# EAGLE design Barometer 022 (EAGLE 9.6.2)

## Sheet 1 of 4
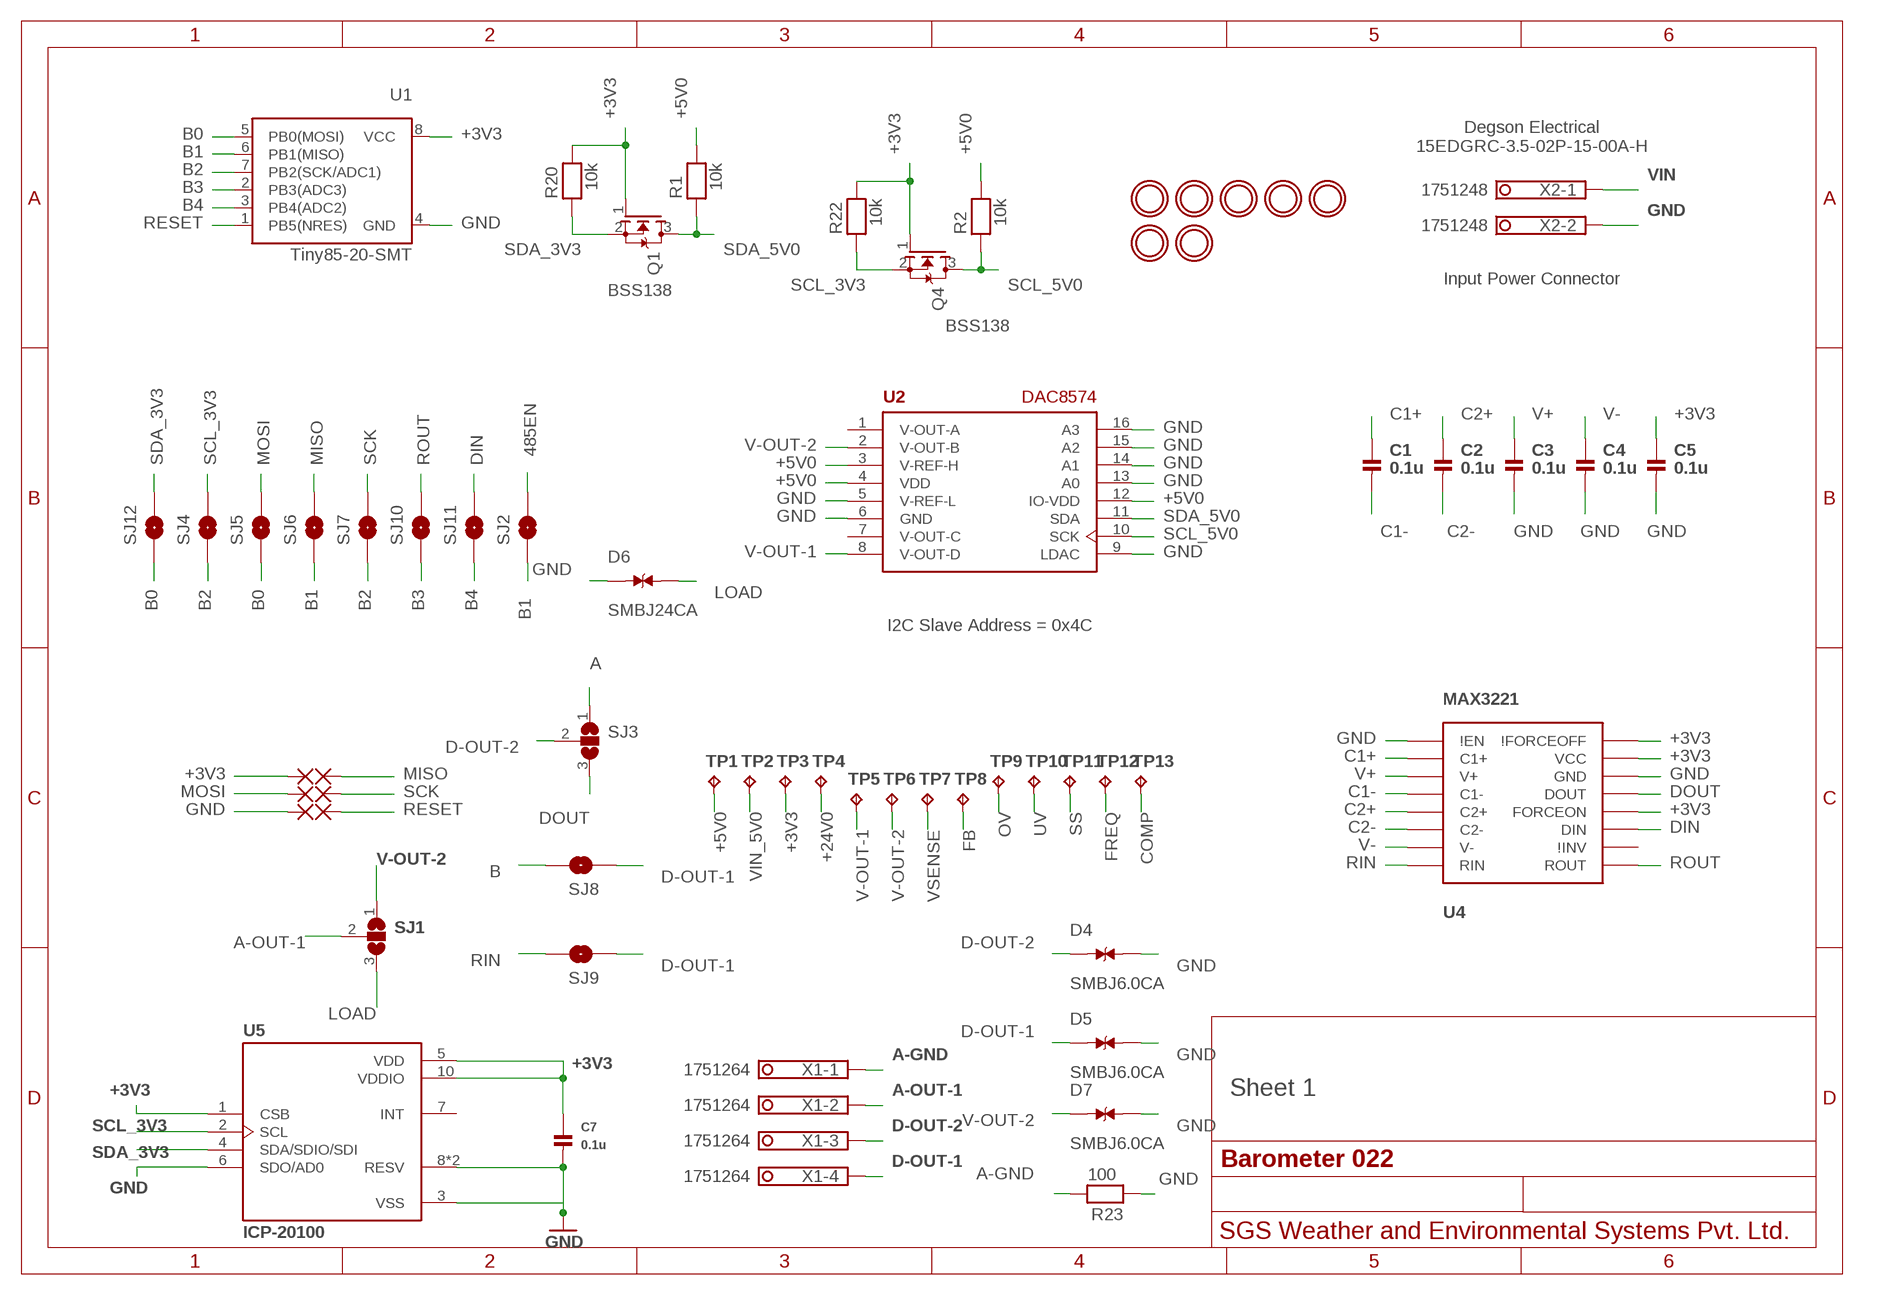
[diagram p0: schematic, sheet 1]

### Parts
C1  0.1u  CAP_CERAMIC0603  [0603@1]
C2  0.1u  CAP_CERAMIC0603  [0603@1]
C3  0.1u  CAP_CERAMIC0603  [0603@1]
C4  0.1u  CAP_CERAMIC0603  [0603@1]
C5  0.1u  CAP_CERAMIC0603  [0603@1]
C7  0.1u  CAP_CERAMIC0603  [0603@1]
D4  SMBJ6.0CA  [DIOM4336X265N]
D5  SMBJ6.0CA  [DIOM4336X265N]
D6  SMBJ24CA  [DIOM4336X265N]
D7  SMBJ6.0CA  [DIOM4336X265N]
PAD1  SMD2  [SMD1,27-2,54]
PAD2  SMD2  [SMD1,27-2,54]
PAD3  SMD2  [SMD1,27-2,54]
PAD4  SMD2  [SMD1,27-2,54]
PAD5  SMD2  [SMD1,27-2,54]
PAD6  SMD2  [SMD1,27-2,54]
Q1  MOSFET-NWIDE  [SOT23-WIDE]
Q4  MOSFET-NWIDE  [SOT23-WIDE]
R1  10k  RESISTOR0603  [0603]
R2  10k  RESISTOR0603  [0603]
R20  10k  RESISTOR0603  [0603]
R22  10k  RESISTOR0603  [0603]
R23  100  RESISTOR0603  [0603]
SJ1  SJ2WW  [SJ_2W]
SJ2  SOLDERJUMPERTRACE  [SJ_2S-TRACE]
SJ3  SJ2W  [SJ_2]
SJ4  SOLDERJUMPERTRACE  [SJ_2S-TRACE]
SJ5  SOLDERJUMPERTRACE  [SJ_2S-TRACE]
SJ6  SOLDERJUMPERTRACE  [SJ_2S-TRACE]
SJ7  SOLDERJUMPERTRACE  [SJ_2S-TRACE]
SJ8  SOLDERJUMPERTRACE  [SJ_2S-TRACE]
SJ9  SOLDERJUMPERTRACE  [SJ_2S-TRACE]
SJ10  SOLDERJUMPERTRACE  [SJ_2S-TRACE]
SJ11  SOLDERJUMPERTRACE  [SJ_2S-TRACE]
SJ12  SOLDERJUMPERNO  [SJ_2S-NO]
TP1  TPB1,27  [B1,27]
TP2  TPB1,27  [B1,27]
TP3  TPB1,27  [B1,27]
TP4  TPB1,27  [B1,27]
TP5  TPB1,27  [B1,27]
TP6  TPB1,27  [B1,27]
TP7  TPB1,27  [B1,27]
TP8  TPB1,27  [B1,27]
TP9  TPB1,27  [B1,27]
TP10  TPB1,27  [B1,27]
TP11  TPB1,27  [B1,27]
TP12  TPB1,27  [B1,27]
TP13  TPB1,27  [B1,27]
U1  Tiny85-20-SMT  ATTINY45TINY85-20-SMT  [SO08-EIAJ_MCU]
U2  DAC8574  [TSSOP16]
U4  MAX3221  MAX3221-TSSOP16  [TSSOP16]
U5  ICP-20100  [PQFN50P200X200X85-10N]
U$1  MOUNTINGHOLE3.0THIN  [MOUNTINGHOLE_3.0_PLATEDTHIN]
U$2  MOUNTINGHOLE3.0THIN  [MOUNTINGHOLE_3.0_PLATEDTHIN]
U$3  MOUNTINGHOLE3.0THIN  [MOUNTINGHOLE_3.0_PLATEDTHIN]
U$4  MOUNTINGHOLE3.0THIN  [MOUNTINGHOLE_3.0_PLATEDTHIN]
U$5  MOUNTINGHOLE3.0THIN  [MOUNTINGHOLE_3.0_PLATEDTHIN]
U$6  MOUNTINGHOLE3.0THIN  [MOUNTINGHOLE_3.0_PLATEDTHIN]
U$7  MOUNTINGHOLE3.0THIN  [MOUNTINGHOLE_3.0_PLATEDTHIN]
X1  1751264  [1751264]
X2  1751248  [1751248]

### Nets
485EN: SJ2.2 ; also sheet 3
+3V3: C5.1 C7.1 PAD1.1(P) Q1.1(G) Q4.1(G) R20.2 R22.2 TP3.TP U1.8(VCC) U4.12(FORCEON) U4.15(VCC) U4.16(\!FORCEOFF) U5.1(CSB) U5.5(VDD) U5.10(VDDIO) ; also sheet 2,3
+5V0: R1.2 R2.2 TP1.TP U2.3(V-REF-H) U2.4(VDD) U2.12(IO-VDD) ; also sheet 2
+24V0: TP4.TP ; also sheet 2,3
A: SJ3.1 ; also sheet 3
A-GND: R23.2 X1.1
A-OUT-1: SJ1.2 X1.2
B: SJ8.2 ; also sheet 3
B0: SJ5.1 SJ12.1 U1.5(PB0(MOSI))
B1: SJ2.1 SJ6.1 U1.6(PB1(MISO))
B2: SJ4.1 SJ7.1 U1.7(PB2(SCK/ADC1))
B3: SJ10.1 U1.2(PB3(ADC3))
B4: SJ11.1 U1.3(PB4(ADC2))
C1+: C1.1 U4.2(C1+)
C1-: C1.2 U4.4(C1-)
C2+: C2.1 U4.5(C2+)
C2-: C2.2 U4.6(C2-)
COMP: TP13.TP ; also sheet 2
D-OUT-1: D5.1 SJ8.1 SJ9.1 X1.4
D-OUT-2: D4.1 SJ3.2 X1.3
DIN: SJ11.2 U4.11(DIN) ; also sheet 3
DOUT: SJ3.3 U4.13(DOUT)
FB: TP8.TP ; also sheet 2
FREQ: TP12.TP ; also sheet 2
GND: C3.2 C4.2 C5.2 C7.2 D4.2 D5.2 D6.1 D7.2 PAD5.1(P) R23.1 U1.4(GND) U2.5(V-REF-L) U2.6(GND) U2.9(LDAC) U2.13(A0) U2.14(A1) U2.15(A2) U2.16(A3) U4.1(\!EN) U4.14(GND) U5.3(VSS) U5.6(SDO/AD0) U5.8(RESV) U5.9(RESV) X2.2 ; also sheet 2,3
LOAD: D6.2 SJ1.3 ; also sheet 3
MISO: PAD2.1(P) SJ6.2
MOSI: PAD3.1(P) SJ5.2
OV: TP9.TP ; also sheet 2
RESET: PAD6.1(P) U1.1(PB5(NRES))
RIN: SJ9.2 U4.8(RIN)
ROUT: SJ10.2 U4.9(ROUT) ; also sheet 3
SCK: PAD4.1(P) SJ7.2
SCL_3V3: Q4.2(S) R22.1 SJ4.2 U5.2(SCL)
SCL_5V0: Q4.3(D) R2.1 U2.10(SCK)
SDA_3V3: Q1.2(S) R20.1 SJ12.2 U5.4(SDA/SDIO/SDI)
SDA_5V0: Q1.3(D) R1.1 U2.11(SDA)
SS: TP11.TP ; also sheet 2
UV: TP10.TP ; also sheet 2
V+: C3.1 U4.3(V+)
V-: C4.1 U4.7(V-)
V-OUT-1: TP5.TP U2.8(V-OUT-D) ; also sheet 3
V-OUT-2: D7.1 SJ1.1 TP6.TP U2.2(V-OUT-B)
VIN: X2.1 ; also sheet 2
VIN_5V0: TP2.TP ; also sheet 2
VSENSE: TP7.TP ; also sheet 2
Unconnected: U2.1(V-OUT-A) U2.7(V-OUT-C) U4.10(\!INV) U5.7(INT)

### Notes on the sheet
- Degson Electrical
  15EDGRC-3.5-02P-15-00A-H
- Input Power Connector
- BSS138
- BSS138
- I2C Slave Address = 0x4C
- Sheet 1

## Sheet 2 of 4
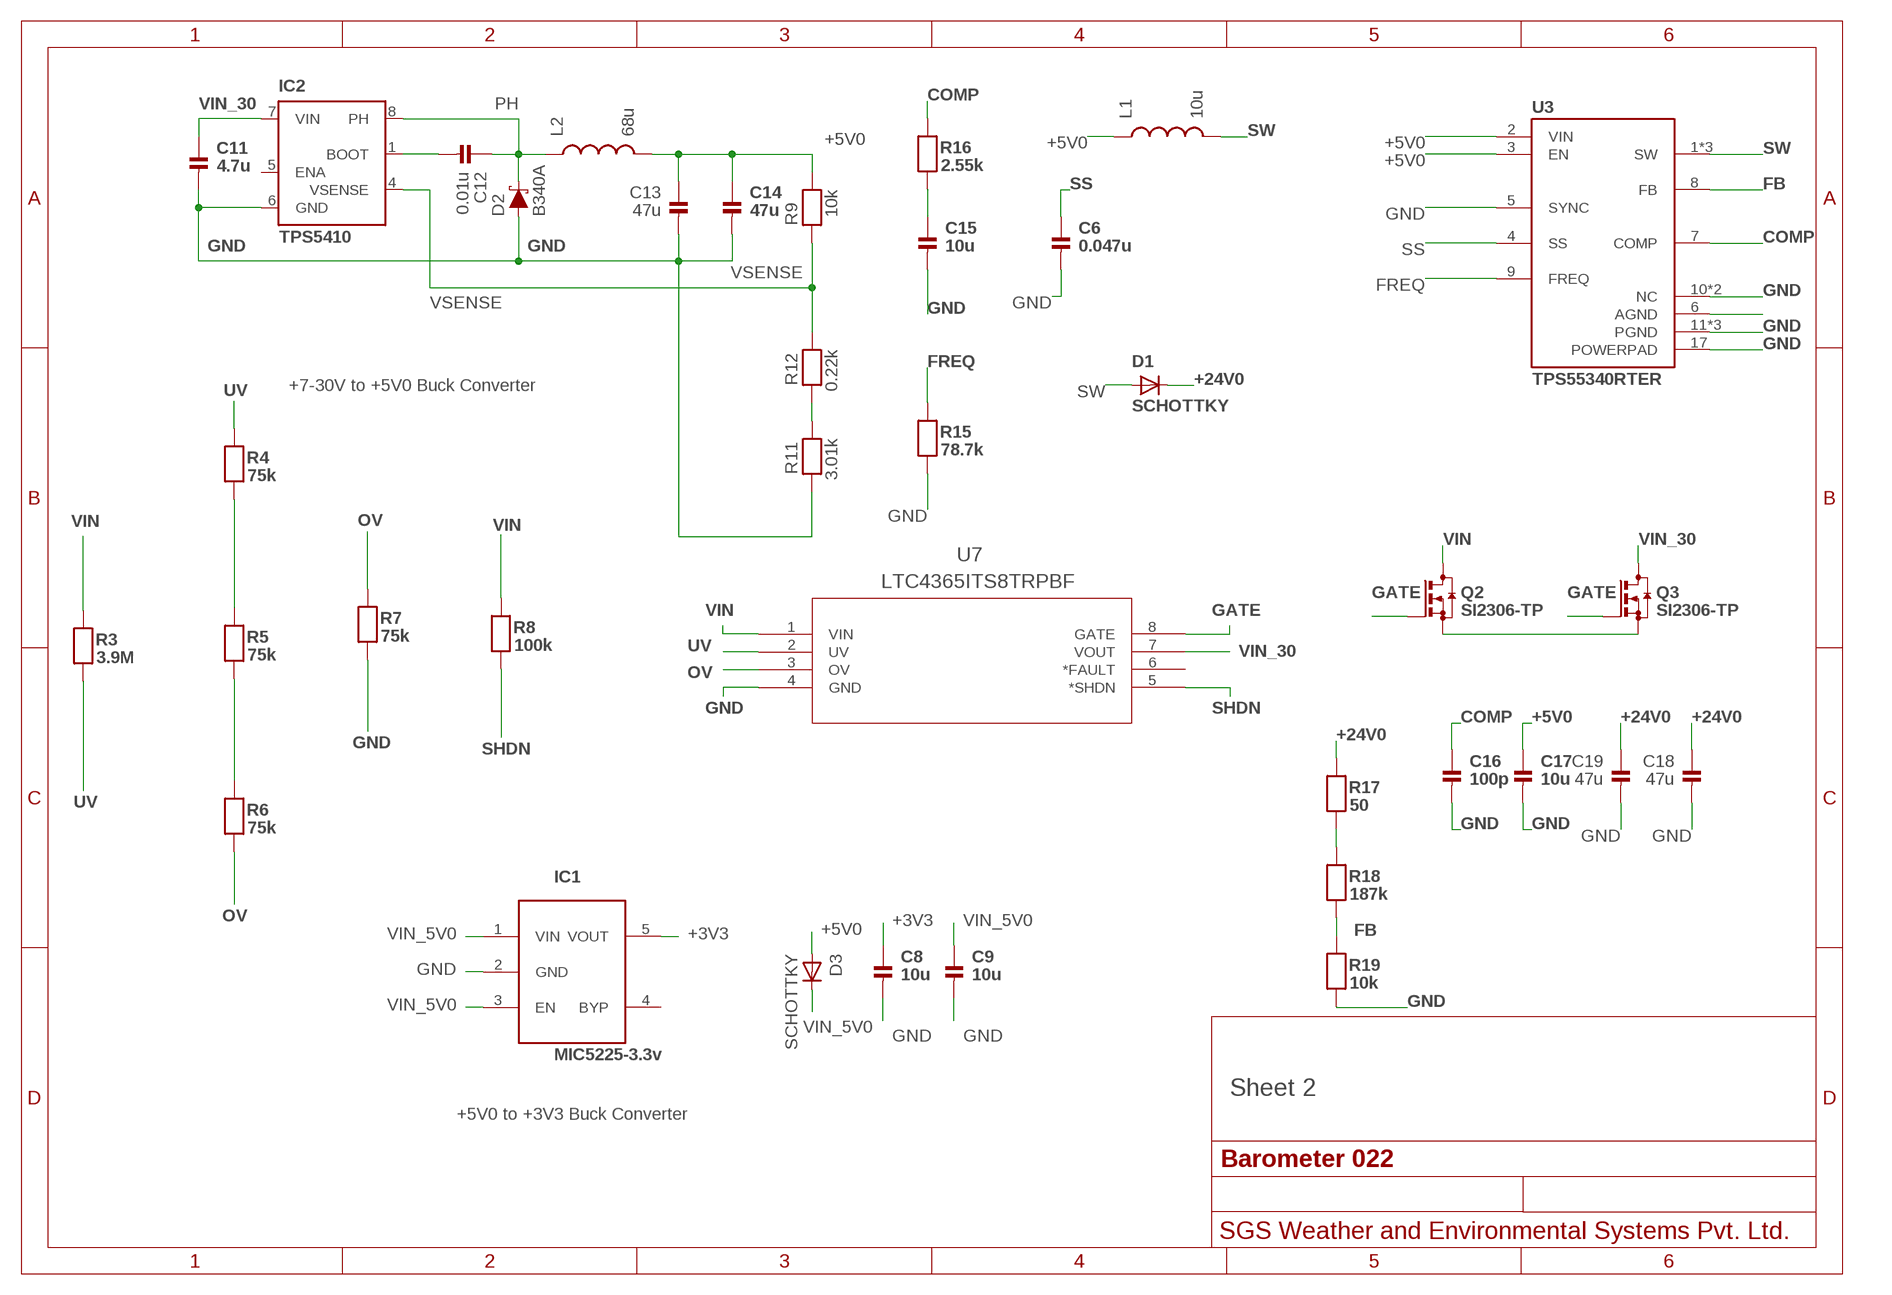
[diagram p1: schematic, sheet 2]

### Parts
C6  0.047u  CAP_CERAMIC0603  [0603@1]
C8  10u  CAP_CERAMIC0603  [0603@1]
C9  10u  CAP_CERAMIC0603  [0603@1]
C11  4.7u  CAP_CERAMIC0805  [0805@1]
C12  0.01u  CAP_CERAMIC0603  [0603@1]
C13  47u  CAP_CERAMIC1206  [1206@1]
C14  47u  CAP_CERAMIC1206  [1206@1]
C15  10u  CAP_CERAMIC0603  [0603@1]
C16  100p  CAP_CERAMIC0603  [0603@1]
C17  10u  CAP_CERAMIC0603  [0603@1]
C18  47u  CAP_CERAMIC1206  [1206@1]
C19  47u  CAP_CERAMIC1206  [1206@1]
D1  SCHOTTKY  DIODE_SOD-123FL  [SOD-123FL]
D2  B340A  DIODE-SCHOTTKY-B340A  [SMA-DIODE]
D3  SCHOTTKY  DIODE_SOD-123FL  [SOD-123FL]
IC1  MIC5225-3.3v  LP298XS  [SOT23-5L]
IC2  TPS5410  [D_R-PDSO-G08]
L1  10u  INDUCTOR-TDKVLS6045EX  [VLS6045EX]
L2  68u  INDUCTOR-TDKVLS6045EX  [VLS6045EX]
Q2  SI2306-TP  BSS123  [SOT23]
Q3  SI2306-TP  BSS123  [SOT23]
R3  3.9M  RESISTOR0603  [0603]
R4  75k  RESISTOR0603  [0603]
R5  75k  RESISTOR0603  [0603]
R6  75k  RESISTOR0603  [0603]
R7  75k  RESISTOR0603  [0603]
R8  100k  RESISTOR0603  [0603]
R9  10k  RESISTOR0603  [0603]
R11  3.01k  RESISTOR0603  [0603]
R12  0.22k  RESISTOR0603  [0603]
R15  78.7k  RESISTOR0603  [0603]
R16  2.55k  RESISTOR0603  [0603]
R17  50  RESISTOR0603  [0603]
R18  187k  RESISTOR0603  [0603]
R19  10k  RESISTOR0603  [0603]
U3  TPS55340RTER  [QFN50P300X300X80-17N]
U7  LTC4365ITS8TRPBF  [TSOT-23_TS8]

### Nets
+3V3: C8.1 IC1.5(VOUT) ; also sheet 1,3
+5V0: C13.1 C14.1 C17.1 D3.A L1.1 L2.2 R9.2 U3.2(VIN) U3.3(EN) ; also sheet 1
+24V0: C18.1 C19.1 D1.C R17.2 ; also sheet 1,3
BOOT1: C12.2 IC2.1(BOOT)
COMP: C16.1 R16.2 U3.7(COMP) ; also sheet 1
FB: R18.1 R19.2 U3.8(FB) ; also sheet 1
FREQ: R15.2 U3.9(FREQ) ; also sheet 1
GATE: Q2.1(G) Q3.1(G) U7.8(GATE)
GND: C6.2 C8.2 C9.2 C11.2 C13.2 C14.2 C15.2 C16.2 C17.2 C18.2 C19.2 D2.A IC1.2(GND) IC2.6(GND) R7.1 R11.1 R15.1 R19.1 U3.5(SYNC) U3.10(NC) U3.11(PGND) U3.12(PGND) U3.13(PGND) U3.14(NC) U3.17(POWERPAD) U7.4(GND) ; also sheet 1,3
N$1: C15.1 R16.1
N$2: R4.1 R5.2
N$3: Q2.2(S) Q3.2(S)
N$4: R5.1 R6.2
N$5: R11.2 R12.1
N$6: R17.1 R18.2
N$7: U3.6(AGND)
OV: R6.1 R7.2 U7.3(OV) ; also sheet 1
PH: C12.1 D2.C IC2.8(PH) L2.1
SHDN: R8.1 U7.5(*SHDN)
SS: C6.1 U3.4(SS) ; also sheet 1
SW: D1.A L1.2 U3.1(SW) U3.15(SW) U3.16(SW)
UV: R3.1 R4.2 U7.2(UV) ; also sheet 1
VIN: Q2.3(D) R3.2 R8.2 U7.1(VIN) ; also sheet 1
VIN_5V0: C9.1 D3.C IC1.1(VIN) IC1.3(EN) ; also sheet 1
VIN_30: C11.1 IC2.7(VIN) Q3.3(D) U7.7(VOUT)
VSENSE: IC2.4(VSENSE) R9.1 R12.2 ; also sheet 1
Unconnected: IC1.4(BYP) IC2.5(ENA) U7.6(*FAULT)

### Notes on the sheet
- +7-30V to +5V0 Buck Converter
- Sheet 2
- +5V0 to +3V3 Buck Converter

## Sheet 3 of 4
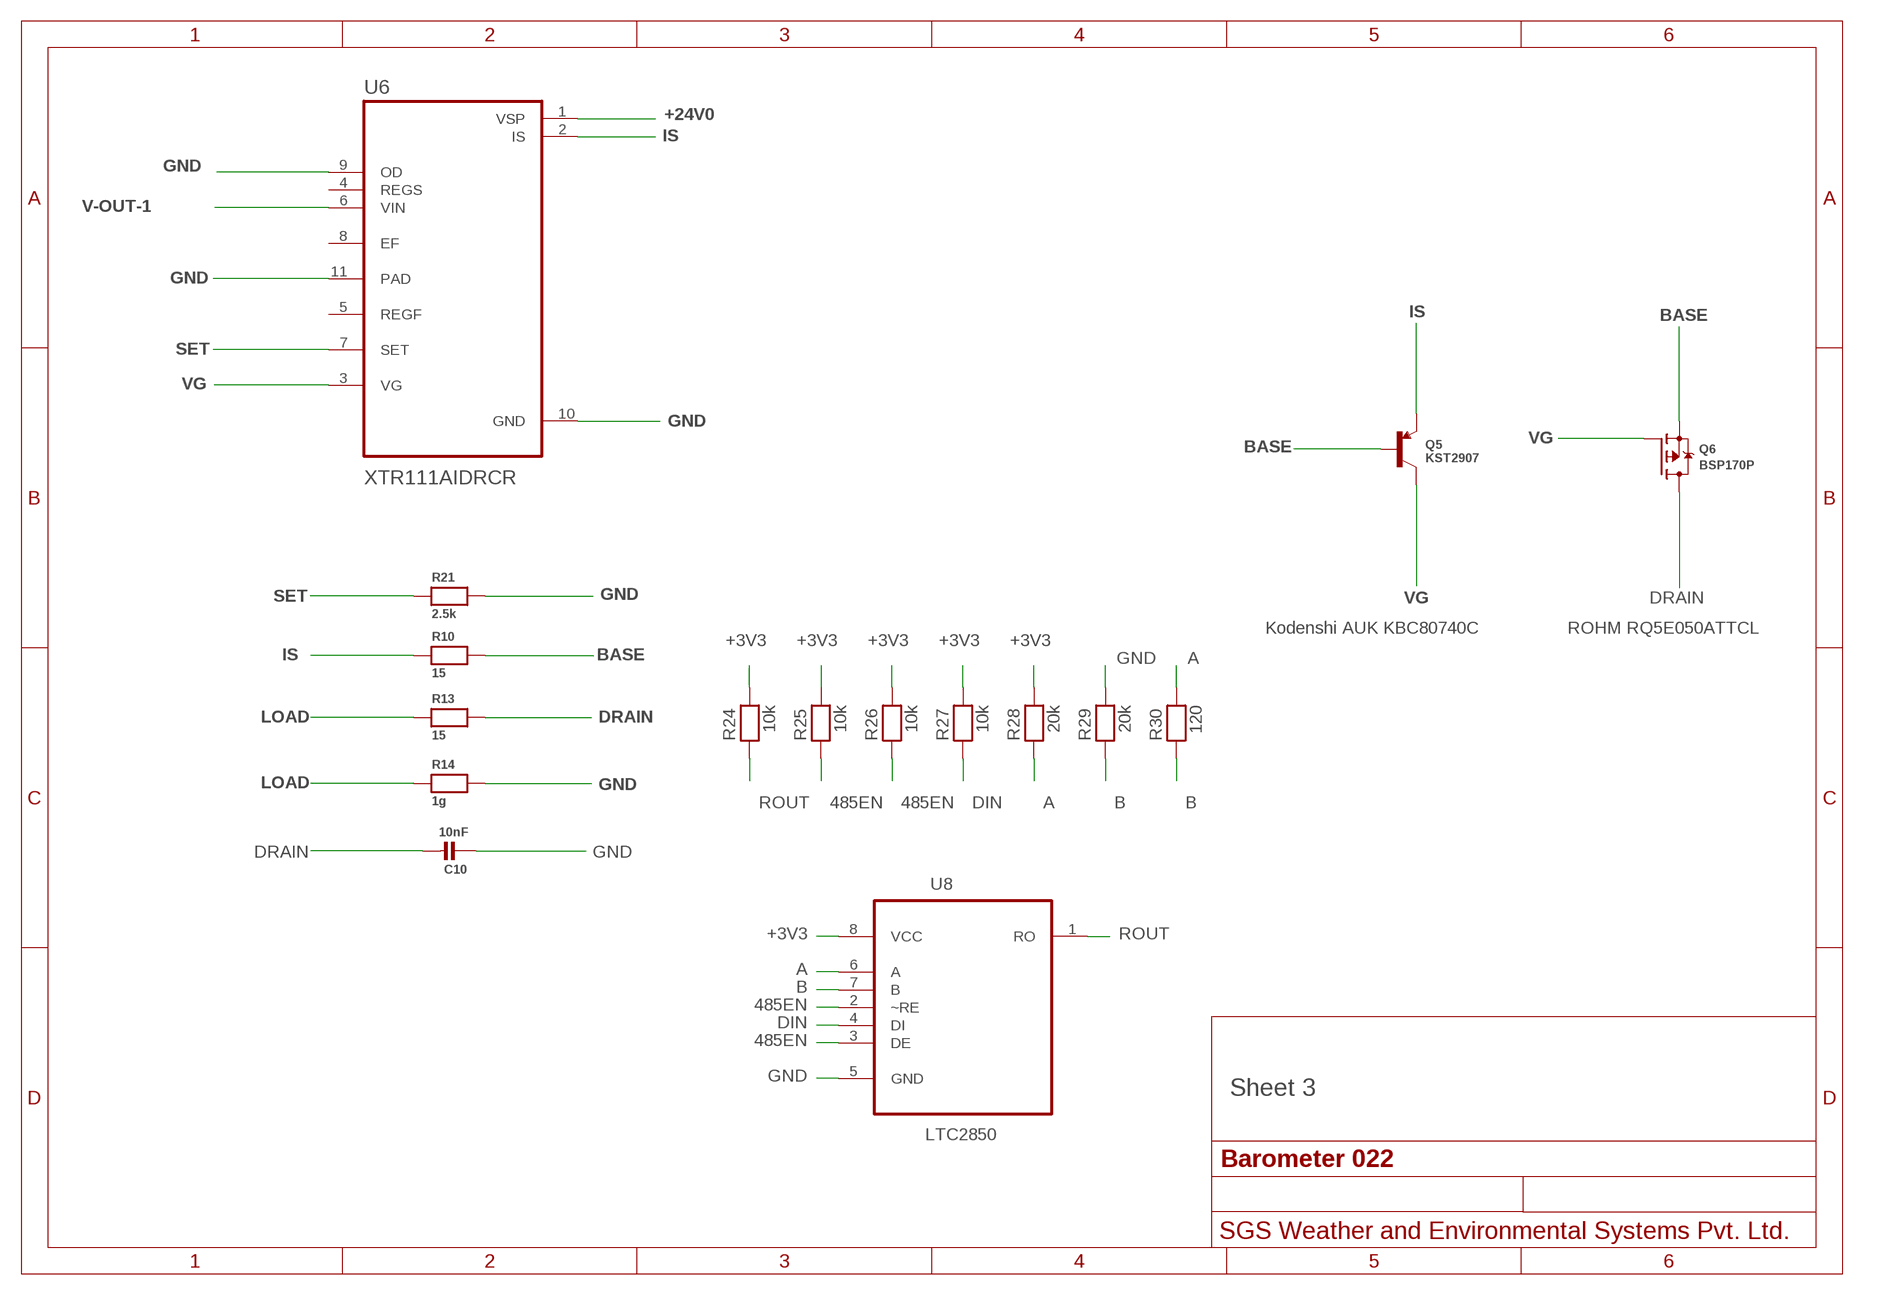
[diagram p2: schematic, sheet 3]

### Parts
C10  10nF  CAP_CERAMIC0603  [0603@1]
Q5  KST2907  TRANSISTOR_PNPSOT23-REFLOW  [SOT23-R]
Q6  BSP170P  MOSFET-P  [SOT23-R]
R10  15  RESISTOR0603  [0603]
R13  15  RESISTOR0603  [0603]
R14  1g  RESISTOR0603  [0603]
R21  2.5k  RESISTOR0603  [0603]
R24  10k  RESISTOR0603  [0603]
R25  10k  RESISTOR0603  [0603]
R26  10k  RESISTOR0603  [0603]
R27  10k  RESISTOR0603  [0603]
R28  20k  RESISTOR0603  [0603]
R29  20k  RESISTOR0603  [0603]
R30  120  RESISTOR0603  [0603]
U6  XTR111AIDRCR  [VREG_V62/16624-01YE]
U8  LTC2850  LTC2850IS8PBF  [SOIC127P600X175-8N]

### Nets
485EN: R25.1 R26.1 U8.2(~RE) U8.3(DE) ; also sheet 1
+3V3: R24.2 R25.2 R26.2 R27.2 R28.2 U8.8(VCC) ; also sheet 1,2
+24V0: U6.1(VSP) ; also sheet 1,2
A: R28.1 R30.2 U8.6(A) ; also sheet 1
B: R29.1 R30.1 U8.7(B) ; also sheet 1
BASE: Q5.1(B) Q6.2(S) R10.2
DIN: R27.1 U8.4(DI) ; also sheet 1
DRAIN: C10.2 Q6.3(D) R13.2
GND: C10.1 R14.2 R21.2 R29.2 U6.9(OD) U6.10(GND) U6.11(PAD) U8.5(GND) ; also sheet 1,2
IS: Q5.2(E) R10.1 U6.2(IS)
LOAD: R13.1 R14.1 ; also sheet 1
ROUT: R24.1 U8.1(RO) ; also sheet 1
SET: R21.1 U6.7(SET)
V-OUT-1: U6.6(VIN) ; also sheet 1
VG: Q5.3(C) Q6.1(G) U6.3(VG)
Unconnected: U6.4(REGS) U6.5(REGF) U6.8(EF)

### Notes on the sheet
- Kodenshi AUK KBC80740C | ROHM RQ5E050ATTCL
- Sheet 3

## Sheet 4 of 4
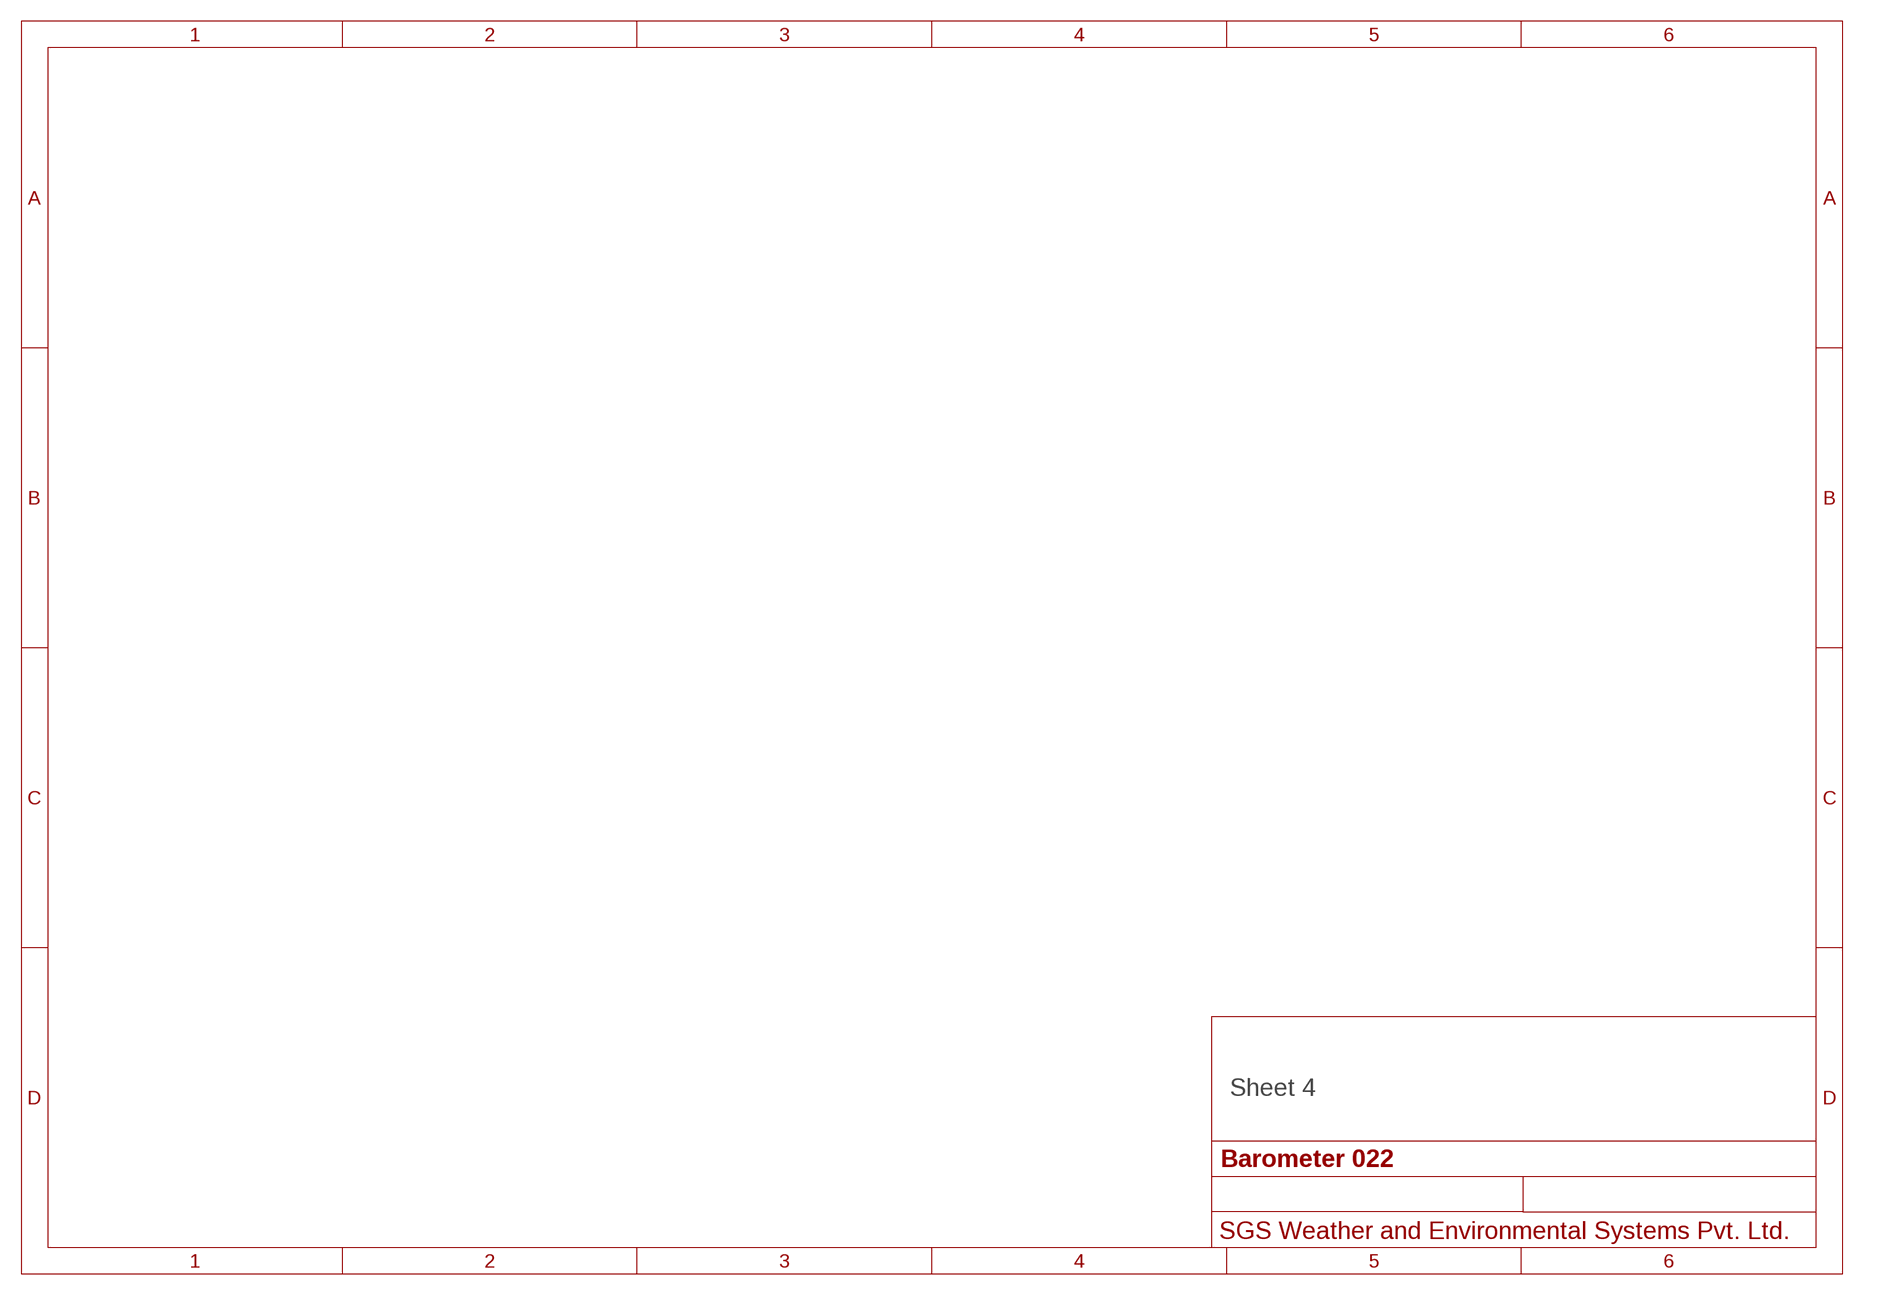
[diagram p3: schematic, sheet 4]

### Notes on the sheet
- Sheet 4

## Library data of the parts
C1-C19 = microbuilder:CAP_CERAMIC: Ceramic Capacitors 0402 - 0402 Surface Mount Capacitors 16pF 50V 5% [Digikey: 445-4899-2-ND] 18pF 50V 5% [Digikey: 490-1281-2-ND] 22pF 50V 5% [Digikey: 490-1283-2-ND] 68pF 50V 5% [Digikey: 490-1289-2-ND] 0.1uF 10V 10% [Digikey: 490-1318-2-ND] 1.0uF 6.3V 10% [Digikey: 490-1320-2-ND] 0603 - 0603 Surface Mount Capacitors 16 pF 50V 5% [Digikey: 445-5051-2-ND] 22 pF 50V [Digikey: PCC220ACVTR-ND] 33 pF 50V 5% [Digikey: 490-1415-1-ND] 56pF 50V 5% [Digikey: 490-1421-1-ND] 220pF 50V 5% [Digikey: 445-1285-1-ND] 680 pF 50V 2200 pF 50V 5% C0G [Digikey: 445-1297-1-ND] 5600 pF 100V 5% X7R [Digikey: 478-3711-1-ND] 0.1 µF 25V 10% [Digikey: PCC2277TR-ND] 0.22 µF 16V 10% X7R [Digikey: 445-1318-1-ND] 1.0 µF 25V 10% [Digikey: 445-5146-2-ND] 0603 - RF Specific 3pF 250V +/-0.1pF RF [Digikey: 712-1347-1-ND] 18 pF 250V 5% [Digikey: 478-3505-1-ND or 712-1322-1-ND] 56 pF 250V 5% C0G RF [Digikey: 490-4867-1-ND] 68 pF 250V RF [Digikey: 490-4868-1-ND] 0805 - 0805 Surface Mount Capacitors 220 pF 250V 2% RF Ceramic Capacitor [Digikey: 712-1398-1-ND] 1000 pF 50V 2% NP0 Ceramic Capacitor [Digikey: 478-3760-1-ND] 0.1 µF 25V 10% Ceramic Capacitor [Digikey: PCC1828TR-ND] 1.0 µF 16V 10% Ceramic Capacitor[Digikey: 490-1691-2-ND] 10.0 µF 10V 10% Ceramic Capacitor[Digikey: 709-1228-1-ND] 10.0 uF 16V 10% Ceramic Capacitor [Digikey: 478-5165-2-ND] 47 uF 6.3V 20% Ceramic Capacitor [Digikey: 587-1779-1-ND or 399-5506-1-ND] 1206 - 1206 Surface Mount Capacitors 47uF 10V 20% Ceramic Capacitor [Digikey: 490-5528-1-ND or 399-5508-1-ND or 445-6010-1-ND] 100uF 6.3V -20%, +80% Y5V Ceramic Capacitor (Digikey: 490-4512-1-ND, Mouser: 81-GRM31CF50J107ZE1L)
D1 D3 = adafruit:DIODE: Diode SMADIODE - SMA Surface Mount Package 20V 1A Schottky Diode Digikey: 641-1014-6-ND DO-1N4148 - Through Hole Small Current Diode SOD-123 20V 1 A (.5mV Vf) Schottky Diode - Digikey: MBRX120TPMSCT-ND SOD-323 10V 570mA (.38mV Vf, 3ns) Schottky Diode - Digikey: ZLLS410CT-ND SOD-523 30V 30mA Schottky Diode (RB751S-40TE61) - Digikey: RB751S-40TE61CT-ND SOT23-R/W - SOT23 Package (R = Solder Paste/Reflow Ovens, W = Hand-Soldering) BAT54Film 40V 300mA - Digikey: 497-7162-1-ND
D2 = SparkFun-DiscreteSemi:DIODE-SCHOTTKY: Schottky diode A Schottky diode is a semiconductor diode which has a low forward voltage drop and a very fast switching action.; PROD_ID: DIO-09886; VALUE: 3A/40V/500mV
D4 D5 D7 = SMBJ6.0CA:SMBJ6.0CA: Check availability <https://pricing.snapeda.com/parts/SMBJ6.0CA/Bourns/view-part?ref=eda>; AVAILABILITY: In Stock; DESCRIPTION: 10.3V Clamp 58.3A Ipp Tvs Diode Surface Mount SMB (DO-214AA); MF: Bourns; MP: SMBJ6.0CA; PACKAGE: DO-214 Bourns; PRICE: None; PURCHASE-URL: https://pricing.snapeda.com/search/part/SMBJ6.0CA/?ref=eda
D6 = SMBJ24CA:SMBJ24CA; DESCRIPTION: 600W, 28.1V, 5%, Bidirectional, TVS; DIGI-KEY_PART_NUMBER: SMBJ24CAFSTR-ND; MF: Taiwan Semiconductor; MP: SMBJ24CA; PACKAGE: SMB Taiwan Semiconductor; PURCHASE-URL: https://pricing.snapeda.com/search/part/SMBJ24CA/?ref=eda
IC1 = adafruit:LP298X
IC2 = texas:TPS5410: 1-A, WIDE INPUT RANGE, STEP-DOWN SWIFT? CONVERTER Source: U7 Texas TPS5410 Step Down Converter.pdf; MPN: TPS5410DR; OC_FARNELL: 1329596; OC_NEWARK: 18M3223
L1 L2 = inductor-tdk:INDUCTOR-TDK: Inductors Basic Inductor/Choke
PAD1-PAD6 = wirepad:SMD2: SMD PAD
Q1 Q4 = microbuilder:MOSFET-N: N-Channel Mosfet LEGEND VDS: Voltage Drain-Source ID: Drain Current RDS(ON): Drain-Source On-State Resistance VGS(TH): Gate-Source Threshold Voltage CISS: Drain-Source Input Capacitance SOT-23 Name VDS ID RDS(ON) VGS(TH) CISS Order Number 2N7002E 60V 260mA 2.5 Ohm 2.5V @ 250uA 26.7pF @ 25V 2N7002ET1GOSTR-ND BSH103 30V 850mA 400 mOhm 400mV @ 1mA 83pF @ 24V BSH103,235-ND BSS138 60V 320mA 1.6 Ohm 1.5V @ 250uA 50pF @ 10V Mouser: 771-BSS138PW115 DMN2075U-7 20V 4.2A 38 mOhm 1V @ 250 uA 594.3pF @ 10V DMN2075U-7DICT-ND * BSS138 good choice for I2C level-shifting
Q2 Q3 = transistor-small-signal:BSS123: N-CHANNEL MOS FET
Q5 = microbuilder:TRANSISTOR_PNP: PNP Transistor Transistor (PNP) 800mA 60V, 1.6V VCE @ 500mA [Digikey: MMBT2907AFSTR-ND] Transistor (PNP) Low Sat - 1.5A 20V, 260mV VCE @ 400mA [Digikey: ZXTP25020DFLTR-ND] SOT23-R - SOT23 footprint optimised for use with solder paste and reflow ovens. SOT23-W - SOT23 footprint optimised for hand-soldering (larger pads).
Q6 = microbuilder:MOSFET-P: P-Channel Mosfet LEGEND VDS: Voltage Drain-Source ID: Drain Current RDS(ON): Drain-Source On-State Resistance VGS(TH): Gate-Source Threshold Voltage CISS: Drain-Source Input Capacitance SOT-23 Name VDS ID RDS(ON) VGS(TH) CISS Order Number IRLML5103 30V 760mA 600 mOhm -- 75pF @ 25V Digikey: IRLML5103PBFCT-ND IRLML6401 12V 4.3A 50 mOhm 950mV @ 250µA 830pF @ 10V Digikey: IRLML6401PBFTR-ND NTR0202PL 20V 400mA 800 mOhm 2.3V @ 250uA 70pF @ 5V Digikey: NTR0202PLT1GOSTR-ND NTR4101PT1G 20V 1.8A 85 mOhm 1.2V @ 250uA 675pF @ 10V Digikey: NTR4101PT1GOSCT-ND DMP2004K 20V 600mA 900 mOhm 1V @ 250uA 175pF @ 16V Digikey: DMP2004KDICT-ND PMV65XP 20V 3.9A 76 mOhm 950mV @ 1mA 725pF @ 20V Digikey: 568-2358-2-ND TO-252 Name VDS ID RDS(ON) VGS(TH) CISS Order Number AOD417 30V 25A 34 mOhm 3V @ 250µA 920pF @ 15V Digikey: 785-1106-2-ND
R1-R30 = microbuilder:RESISTOR: Resistors 0402 - 0402 Surface Mount Package 22 Ohm 1% 1/16W [Digikey: 311-22.0LRTR-ND] 33 Ohm 5% 1/16W 1.0K 5% 1/16W 1.5K 5% 1/16W 2.0K 1% 1/16W 10.0K 1% 1/16W [Digikey: 311-10.0KLRTR-ND] 10.0K 5% 1/16W [Digikey: RMCF0402JT10K0TR-ND] 12.1K 1% 1/16W [Digikey: 311-22.0LRTR-ND] 100.0K 5% 1/16W 0603 - 0603 Surface Mount Package 0 Ohm 1/10 Watt 1% Resistor 15 Ohm 1/10 Watt 1% Resistor 33 Ohm 1/10 Watt 1% Resistor 49.9 Ohm 1/10 Watt 1% Resistor 100 Ohm 1/10 Watt 1% Resistor 150 Ohm 1/10 Watt 1% Resistor 240 Ohm 1/10 Watt 1% Resistor 390 Ohm 1/10 Watt 1% Resistor 560 Ohm 1/10 Watt 1% Resistor 680 Ohm 1/10 Watt 1% Resistor 750 Ohm 1/10 Watt 1% Resistor 1.0K Ohm 1/10 Watt 1% Resistor 1.5K Ohm 1/10 Watt 1% Resistor 2.0K Ohm 1/10 Watt 1% Resistor 2.2K Ohm 1/10 Watt 1% Resistor 3.3K Ohm 1/10 Watt 1% Resistor 4.7K Ohm 1/10 Watt 1% Resistor 10.0K Ohm 1/10 Watt 1% Resistor 12.0K Ohm 1/10 Watt 1% Resistor 12.1K Ohm 1/10 Watt 1% Resistor 20.0K Ohm 1/10 Watt 1% Resistor 33.0K Ohm 1/10 Watt 1% Resistor 100.0K Ohm 1/10 Watt 1% Resistor 0805 - 0805 Surface Mount Package 0 Ohm 1/8 Watt 1% Resistor 33 Ohm 1/8 Watt 1% Resistor 100 Ohm 1/8 Watt 1% Resistor 150 Ohm 1/8 Watt 1% Resistor 200 Ohm 1/8 Watt 1% Resistor 240 Ohm 1/8 Watt 1% Resistor 330 Ohm 1/8 Watt 1% Resistor 390 Ohm 1/8 Watt 1% Resistor 470 Ohm 1/8 Watt 1% Resistor 1.0K Ohm 1/8 Watt 1% Resistor 1.5K Ohm 1/8 Watt 1% Resistor 2.0K Ohm 1/8 Watt 1% Resistor 4.7K Ohm 1/8 Watt 1% Resistor 5.1K Ohm 1/8 Watt 1% Resistor 5.6K Ohm 1/8 Watt 1% Resistor 10.0K Ohm 1/8 Watt 1% Resistor 22.0K Ohm 1/8 Watt 1% Resistor 33.0K Ohm 1/8 Watt 1% Resistor 100K Ohm 1/8 Watt 1% Resistor 1206 - 1206 Surface Mount Package 2012 - 2010 Surface Mount Package 0.11 Ohm 1/2 Watt 1% Resistor - Digikey: RHM.11UCT-ND
SJ1 SJ3 = jumper:SJ2W: SMD solder JUMPER
SJ2 SJ4-SJ12 = SparkFun-Retired-0:SOLDERJUMPER: Solder Jumper Standard SMD solder jumper. Used to automate production. Two varients : Normally Open and Normally Closed are the same, but have different paste layers. NC will have a large amount of paste and should jumper during reflow.
TP1-TP13 = testpad:TP: Test pad
U1 = SparkFun-Retired-0:ATTINY45: Atmel 8-pin 2/4/8kB flash uC Retired; PROD_ID: IC-09092
U2 = texas-msp:DAC8574: The DAC8574 is a low-power, quad channel, 16-bit buffered voltage output DAC. Its on-chip precision output amplifier allows rail-to-rail output swing to be achieved. The DAC8574 utilizes an I2C compatible two wire serial interface supporting high-speed interface mode with address support of up to sixteen DAC8574s for a total of 64 channels on the bus.
U3 = TPS55340RTER:TPS55340RTER: Integrated, 5-A 40-V Wide Input Range Boost/SEPIC/Flyback DC-DC Regulator 16-WQFN -40 to 150 Check availability <https://pricing.snapeda.com/parts/TPS55340RTER/Texas%20Instruments/view-part?ref=eda>; AVAILABILITY: In Stock; DESCRIPTION: 5-A, 40-V, wide VIN boost, flyback, & SEPIC converter; MF: Texas Instruments; MP: TPS55340RTER; PACKAGE: WQFN-16 Texas Instruments; PRICE: None; PURCHASE-URL: https://pricing.snapeda.com/search/part/TPS55340RTER/?ref=eda
U4 = texas-msp:MAX3221
U5 = ICP-20100:ICP-20100: Check availability <https://pricing.snapeda.com/parts/ICP-20100/TDK%20InvenSense/view-part?ref=eda>; AVAILABILITY: In Stock; DESCRIPTION: High Accuracy, Low Power, Barometric Pressure and Temperature Sensor IC; MF: TDK InvenSense; MP: ICP-20100; PACKAGE: None; PRICE: None; PURCHASE-URL: https://pricing.snapeda.com/search/part/ICP-20100/?ref=eda
U6 = XTR111AIDRCR:XTR111AIDRCR: Check availability <https://pricing.snapeda.com/parts/XTR111AIDRCR/Texas%20Instruments/view-part?ref=eda>; AVAILABILITY: In Stock; DESCRIPTION: Voltage-to-current converter/transmitter with 3-V to 15-V regulator and resistor set I/O ratio; MF: Texas Instruments; MP: XTR111AIDRCR; PACKAGE: VSON-10 Texas Instruments; PRICE: None; PURCHASE-URL: https://pricing.snapeda.com/search/part/XTR111AIDRCR/?ref=eda
U7 = LTC4365ITS8TRPBF:LTC4365ITS8TRPBF: Check availability <https://pricing.snapeda.com/parts/LTC4365ITS8%23TRPBF/Analog%20Devices/view-part?ref=eda>; AVAILABILITY: In Stock; DESCRIPTION: Overvoltage, Undervoltage Protection PMIC TSOT-23-8; MF: Analog Devices; MP: LTC4365ITS8#TRPBF; PACKAGE: SOT-8 Analog Devices; PRICE: None; PURCHASE-URL: https://pricing.snapeda.com/search/part/LTC4365ITS8#TRPBF/?ref=eda
U8 = LTC_By_element14_Batch_1:LTC2850IS8PBF: 3.3V 20Mbps RS485/RS422 Transceivers; MPN: LTC2850IS8#PBF; OC_FARNELL: 1663700; OC_NEWARK: 56M6384; PACKAGE: SOIC-8; SUPPLIER: Linear Technology
U$1-U$7 = microbuilder:MOUNTINGHOLE: Mounting Hole For #2 screws (0.086"/2.18mm width, 0.094"/2.4mm hole) use 2.5mm
X1 = con-phoenix-350:1751264: MKDS 1/ 4-3,5 Printklemme Nennstrom: 10 A Bemessungsspannung: 160 V Raster: 3,5 mm Polzahl: 4 Montageart: Löten Anschlussart: Schraubanschluss Anschlussrichtung vom Leiter zur Platine: 0° Source: http://eshop.phoenixcontact.com .. 1751264.pdf; MPN: 1751264; OC_FARNELL: unknown; OC_NEWARK: 10R0934
X2 = con-phoenix-350:1751248: MKDS 1/ 2-3,5 Printklemme Nennstrom: 10 A Bemessungsspannung: 160 V Raster: 3,5 mm Polzahl: 2 Montageart: Löten Anschlussart: Schraubanschluss Anschlussrichtung vom Leiter zur Platine: 0° Source: http://eshop.phoenixcontact.com .. 1751248.pdf; OC_FARNELL: unknown; OC_NEWARK: unknown

## Board
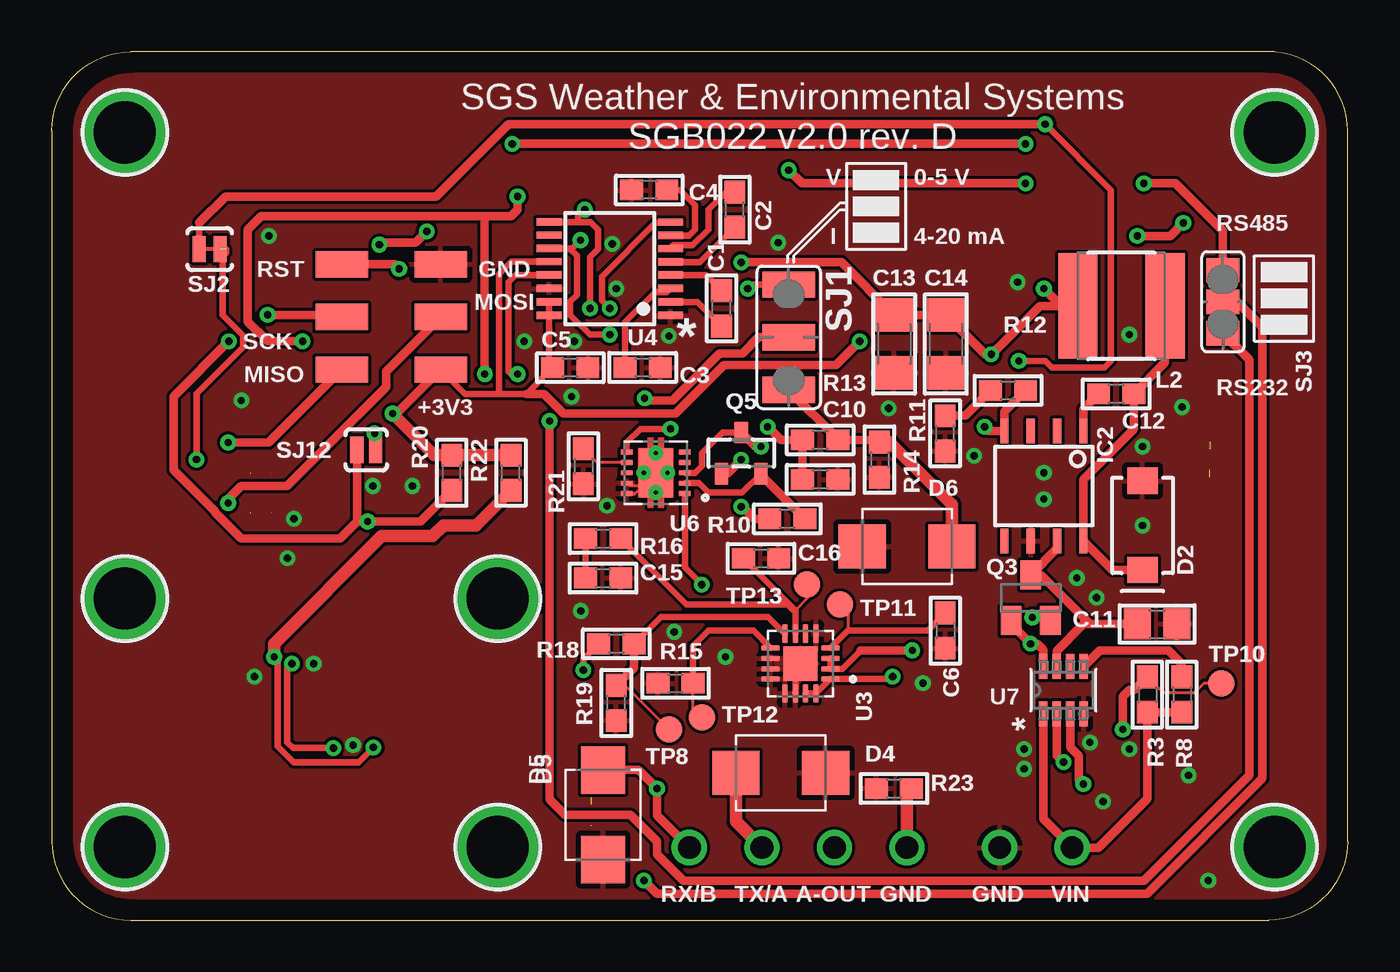
[diagram p4: board, top side]
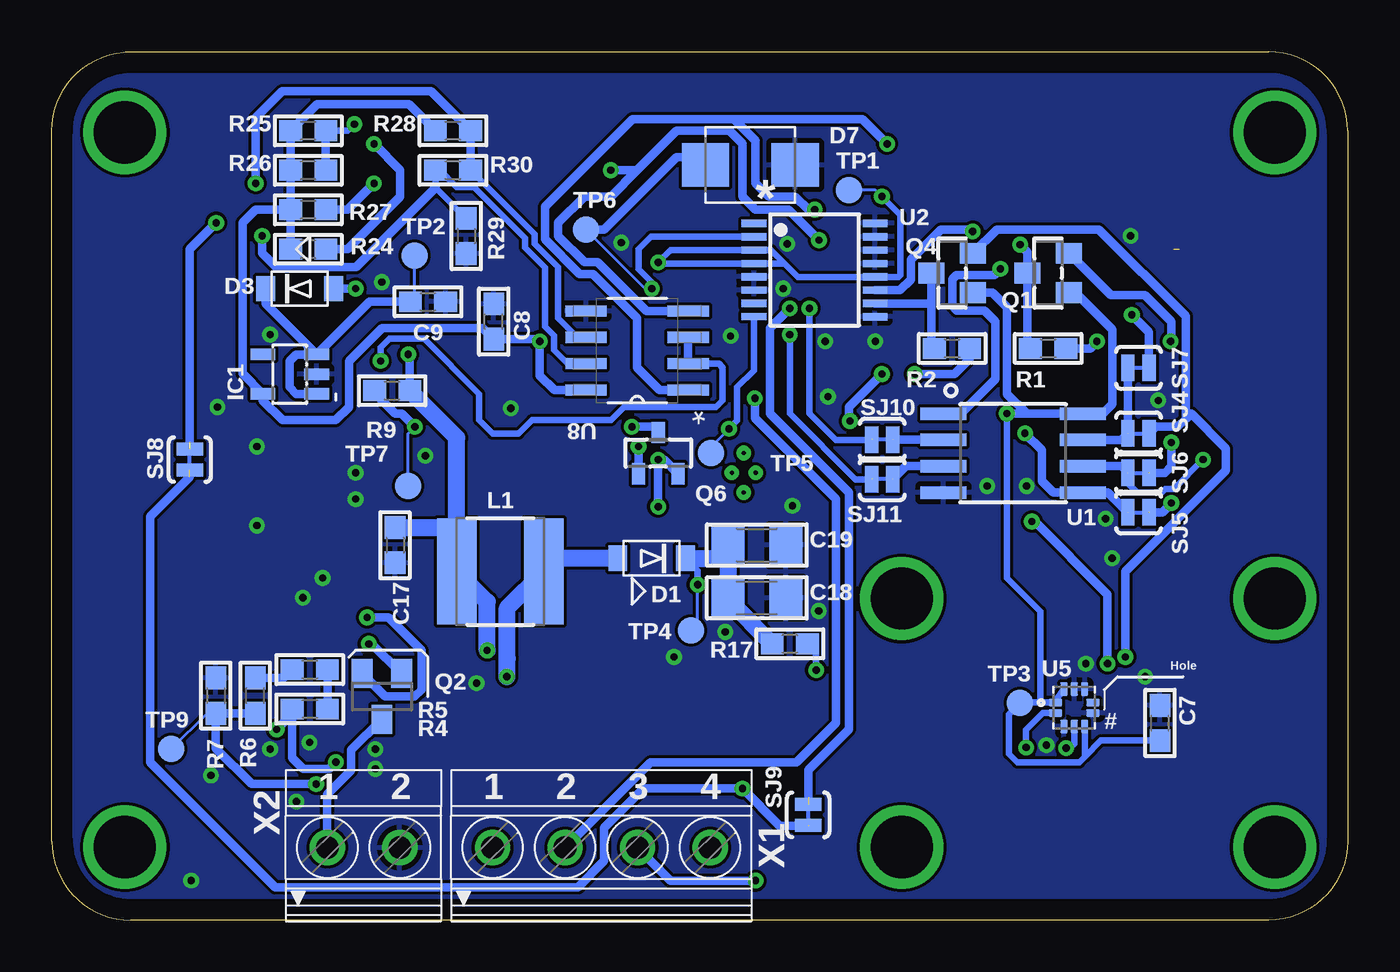
[diagram p5: board, bottom side, seen from below]

Size 62.54 x 41.91 mm. Coordinates in mm from the lower left corner, seen from the top.
Outline: 62.54,38.1 62.54,3.81 arc-90 58.73,0 3.81,0 arc-90 0,3.81 0,38.1 arc-90 3.81,41.91 58.73,41.91
Outline: 62.54,38.1 62.54,38.2
Outline: 59,41.91 58.73,41.91
Outline: 62.54,38.1 arc90 58.73,41.91
Copper layers (1*16): Top 0.035mm / dielectric 1.5mm / Bottom 0.035mm
Design rules "default": minimum track width 6mil, minimum drill 0.35mm, track to track 6mil, track to pad 6mil, pad to pad 6mil, via to via 6mil, smd to smd 6mil, copper to edge 40mil, drill to drill 6mil, minimum pad ring 10mil, minimum via ring 8mil, stop-mask expansion 4mil, vias tented up to drill 0mil, thermal gap 10mil

### Footprints (pad centres in the part's own frame; a part is rotated, then mirrored left to right if it is on the bottom)
0603@1 = smd 1.1 x 1: 1 -0.85,0; 2 0.85,0
0805@1 = smd 1.3 x 1.5: 1 -0.95,0; 2 0.95,0
1206@1 = smd 1.6 x 1.8: 1 -1.4,0; 2 1.4,0
SOD-123FL = smd 0.91 x 1.22: A 1.637,0; C -1.637,0
SMA-DIODE = smd 1.27 x 1.47: A -2.15,0; C 2.15,0
DIOM4336X265N = smd 2.28 x 2.12: 1 -2.165,0; 2 2.165,0
SOT23-5L = smd 0.55 x 1.2: 1 -0.95,-1.3; 2 0,-1.3; 3 0.95,-1.3; 4 0.95,1.3; 5 -0.95,1.3
D_R-PDSO-G08 = smd 0.4 x 1.2: 1 -1.905,-2.65; 2 -0.635,-2.65; 3 0.635,-2.65; 4 1.905,-2.65; 5 1.905,2.65; 6 0.635,2.65; 7 -0.635,2.65; 8 -1.905,2.65
VLS6045EX = smd 1.9 x 5.1: 1 -2.1,0; 2 2.1,0
SMD1,27-2,54 = smd 1.27 x 2.54: 1 0,0
SOT23-WIDE = smd 1 x 1.27: 1 -0.95,-1; 2 0.95,-1; 3 0,1
SOT23 = smd 1 x 1.4: 1 -0.95,-1.1; 2 0.95,-1.1; 3 0,1.1
SOT23-R = smd 0.635 x 1.016: 1 -0.95,-1; 2 0.95,-1; 3 0,1
0603 = smd 1.1 x 1: 1 -0.85,0; 2 0.85,0
SJ_2W = smd 1.27 x 2.54: 1 -2.54,0; 2 0,0; 3 2.54,0
SJ_2S-TRACE = smd 0.635 x 1.27: 1 -0.508,0; 2 0.508,0
SJ_2 = smd 1.168 x 1.6: 1 -1.524,0; 2 0,0; 3 1.524,0
SJ_2S-NO = smd 0.635 x 1.27: 1 -0.45,0; 2 0.45,0
B1,27 = smd 1.27 x 1.27: TP 0,0
SO08-EIAJ_MCU = smd 0.61 x 2.21: 1 -1.905,-3.378; 2 -0.635,-3.378; 3 0.635,-3.378; 4 1.905,-3.378; 5 1.905,3.353; 6 0.635,3.353; 7 -0.635,3.353; 8 -1.905,3.353
TSSOP16 = smd 0.35 x 1.2: 1 -0.975,-2.925; 2 -0.325,-2.925; 3 0.325,-2.925; 4 0.975,-2.925; 5 1.605,-2.925; 6 2.245,-2.925; 7 2.885,-2.925; 8 3.525,-2.925; 9 3.535,2.925; 10 2.895,2.925; 11 2.255,2.925; 12 1.615,2.925; 13 0.975,2.925; 14 0.325,2.925; 15 -0.325,2.925; 16 -0.975,2.925
QFN50P300X300X80-17N = smd 0.89 x 0.26: 1 -1.44,0.75; 2 -1.44,0.25; 3 -1.44,-0.25; 4 -1.44,-0.75; 9 1.44,-0.75; 10 1.44,-0.25; 11 1.44,0.25; 12 1.44,0.75 | smd 0.26 x 0.89: 5 -0.75,-1.44; 6 -0.25,-1.44; 7 0.25,-1.44; 8 0.75,-1.44; 13 0.75,1.44; 14 0.25,1.44; 15 -0.25,1.44; 16 -0.75,1.44 | smd 1.66 x 1.66: 17 0,0
PQFN50P200X200X85-10N = smd 0.644 x 0.35: 1 -0.907,0.25; 2 -0.907,-0.25; 6 0.907,-0.25; 7 0.907,0.25 | smd 0.35 x 0.644: 3 -0.5,-0.907; 4 0,-0.907; 5 0.5,-0.907; 8 0.5,0.907; 9 0,0.907; 10 -0.5,0.907
VREG_V62/16624-01YE = smd 0.6 x 0.24: 1 -1.4,1; 2 -1.4,0.5; 3 -1.4,0; 4 -1.4,-0.5; 5 -1.4,-1; 6 1.4,-1; 7 1.4,-0.5; 8 1.4,0; 9 1.4,0.5; 10 1.4,1 | smd 1.65 x 2.4: 11 0,0 | drill 0.2 pad 0.3: 12 0,-0.95; 13 -0.575,0; 14 0.575,0; 15 0,0.95
TSOT-23_TS8 = smd 1.219 x 0.406: 1 -1.143,0.975; 2 -1.143,0.325; 3 -1.143,-0.325; 4 -1.143,-0.975; 5 1.143,-0.975; 6 1.143,-0.325; 7 1.143,0.325; 8 1.143,0.975
SOIC127P600X175-8N = smd 1.981 x 0.533: 1 -2.464,1.905; 2 -2.464,0.635; 3 -2.464,-0.635; 4 -2.464,-1.905; 5 2.464,-1.905; 6 2.464,-0.635; 7 2.464,0.635; 8 2.464,1.905
MOUNTINGHOLE_3.0_PLATEDTHIN = drill 3 pad 3.6: P$1 0,0
1751264 = drill 1.1 pad 1.7: 1 -5.25,-0.1; 2 -1.75,-0.1; 3 1.75,-0.1; 4 5.25,-0.1
1751248 = drill 1.1 pad 1.7: 1 -1.75,-0.1; 2 1.75,-0.1

### Placement (x,y rotation side)
C1  32.32,29.53 90 top
C2  32.96,34.29 90 top
C3  28.51,26.67 0 top
C4  28.83,35.24 180 top
C5  25.02,26.67 0 top
C6  43.12,13.97 270 top
C7  9.06,9.51 90 bottom
C8  41.21,28.89 90 bottom
C9  44.39,29.84 0 bottom
C10  37.08,21.27 180 top
C11  53.34,14.29 0 top
C12  51.37,25.4 180 top
C13  40.65,27.81 270 top
C14  43.15,27.81 270 top
C15  26.61,16.51 0 top
C16  34.23,17.46 0 top
C17  45.97,18.1 270 bottom
C18  28.51,15.56 0 bottom
C19  28.51,18.1 0 bottom
D1  33.59,17.46 180 bottom
D2  52.64,19.05 270 top
D3  50.58,30.48 0 bottom
D4  35.18,7.11 0 top
D5  26.61,5.08 270 top
D6  41.27,18.03 0 top
D7  28.83,36.45 0 bottom
IC1  51.05,26.35 90 bottom
IC2  47.88,20.95 180 top
L1  40.89,16.83 0 bottom
L2  51.62,29.64 180 top
PAD1  18.77,26.57 270 top
PAD2  13.99,26.57 270 top
PAD3  18.77,29.11 270 top
PAD4  13.99,29.11 270 top
PAD5  18.77,31.66 270 top
PAD6  13.99,31.66 270 top
Q1  14.46,31.23 90 bottom
Q2  46.61,10.79 180 bottom
Q3  47.24,15.56 0 top
Q4  19.09,31.23 90 bottom
Q5  33.27,22.54 0 top
Q6  33.27,22.54 0 bottom
R1  14.46,27.59 0 bottom
R2  19.09,27.59 0 bottom
R3  52.87,10.88 270 top
R4  50.09,10.19 180 bottom
R5  50.09,12.09 0 bottom
R6  52.72,10.83 90 bottom
R7  54.62,10.83 270 bottom
R8  54.53,10.88 270 top
R9  46.11,25.55 0 bottom
R10  35.5,19.37 180 top
R11  43.11,23.5 90 top
R12  46.15,25.56 0 top
R13  37.08,23.18 180 top
R14  39.94,22.23 270 top
R15  30.1,11.43 0 top
R16  26.61,18.41 0 top
R17  26.92,13.34 180 bottom
R18  27.24,13.34 180 top
R19  27.24,10.48 90 top
R20  19.3,21.59 90 top
R21  25.65,21.91 270 top
R22  22.16,21.59 90 top
R23  40.64,6.35 0 top
R24  50.16,32.38 180 bottom
R25  50.16,38.1 180 bottom
R26  50.16,36.19 180 bottom
R27  50.16,34.29 180 bottom
R28  43.18,38.1 180 bottom
R29  42.55,33.02 270 bottom
R30  43.18,36.19 0 bottom
SJ1  35.56,28.13 270 top
SJ2  7.62,32.38 180 top
SJ3  56.52,29.84 270 top
SJ4  10.1,23.49 0 bottom
SJ5  10.1,19.68 0 bottom
SJ6  10.1,21.59 0 bottom
SJ7  10.1,26.66 0 bottom
SJ8  55.88,22.23 90 bottom
SJ9  26.04,5.08 90 bottom
SJ10  22.46,23.18 180 bottom
SJ11  22.46,21.28 180 bottom
SJ12  15.18,22.7 180 top
TP1  24.07,35.24 0 bottom
TP2  45.02,32.07 0 bottom
TP3  15.81,10.48 0 bottom
TP4  31.69,13.97 0 bottom
TP5  30.73,22.54 0 bottom
TP6  36.77,33.34 0 bottom
TP7  45.34,20.95 0 bottom
TP8  29.78,9.21 0 top
TP9  56.77,8.26 0 bottom
TP10  56.45,11.43 0 top
TP11  38.04,15.24 0 top
TP12  31.37,9.78 0 top
TP13  36.45,16.19 0 top
U1  16.13,22.54 270 bottom
U2  25.73,32.66 270 bottom
U3  36.13,12.38 180 top
U4  26.93,30.16 90 top
U5  13.2,10.25 0 bottom
U6  29.15,21.59 180 top
U7  48.82,11.1 90 top
U8  34.29,27.49 180 bottom
U$1  3.52,15.52 0 top
U$2  21.52,15.52 0 top
U$3  21.52,3.52 0 top
U$4  59.02,38.02 0 top
U$5  3.52,3.52 0 top
U$6  3.52,38.02 0 top
U$7  59.02,3.52 0 top
X1  36.02,3.6 0 bottom
X2  47.49,3.6 0 bottom

### Tracks (layer width: path | path; a pad name or v marks a point on that pad's centre or on a via)
485EN  (via drill 0.35)
  Top 0.305: v46.67,26.99 47.94,26.99 48.26,26.67 50.8,26.67 51.12,26.99 51.12,35.24 v47.94,38.42 | SJ2.2 7.11,33.66
  Top 0.406: v47.94,38.42 22.04,38.42 18.54,34.92 8.38,34.92 7.11,33.66
  Bottom 0.305: U8.2 30.35,26.86 30.16,26.67 30.16,25.08 30.48,24.77 34.92,24.77 35.56,24.13 39.37,24.13 40.01,23.5 41.27,23.5 41.91,24.13 41.91,25.4 44.58,28.07 46.23,28.07 46.67,27.62 v46.67,26.99 | R25.1 48.26,38.1 v47.94,38.42
  Bottom 0.406: U8.3 U8.2 | R25.1 R26.1
+3V3  (via drill 0.35)
  Top 0.305: PAD1.1 19.95,25.4 21.59,25.4 | 21.59,25.4 22.9,25.4 C5.1 24,26.84 U4.16 U4.15 | U4.12 22.19,31.78 21.59,31.18 21.59,25.4
  Top 0.406: PAD1.1 16.65,24.45 v16.45,24.45 | 22.9,25.4 23.75,25.4 24.7,24.45 30.1,24.45 32.45,26.8 37.85,26.8 v38.99,27.94
  Top 0.61: v16.45,24.45 18.45,22.44 R20.2 R22.2
  Bottom 0.305: 14.84,10.5 U5.1 13.97,10.75 U5.10 | U5.5 12.7,7.88 | 12.7,7.88 12.95,7.62 15.95,7.62 16.36,8.03 16.36,9.93 TP3.TP 15.79,10.5 14.84,10.5 | v16.45,24.45 16.45,16.51 14.84,14.9 14.84,10.5 | C7.1 11.91,8.66 12.7,7.88
  Bottom 0.406: Q1.1 13.14,30.28 11.37,28.51 11.37,24.9 11.82,24.45 U1.8 15.49,24.45 | Q4.1 17.14,30.28 16.45,29.59 16.45,25.4 15.49,24.45 | v16.45,24.45 15.49,24.45 | U8.8 38.29,25.59 38.99,26.29 v38.99,27.94 39.09,28.04 C8.1 41.75,28.57 46.61,28.57 48.2,26.99 48.2,24.77 48.83,24.13 51.4,24.13 52.35,25.08 IC1.5 53.34,26.39 53.34,33.66 52.7,34.29 R27.2 | R27.2 R26.2 R25.2 49.74,39.37 45.3,39.37 R28.2 | R24.2 R27.2
+5V0  (via drill 0.35)
  Top 0.305: 39.02,13.02 39.02,12.98 38.17,12.13 U3.2 U3.3
  Top 0.406: v47.88,30.48 48.72,29.64 L2.2 47.68,29.64 v45.34,27.3 45.05,27.3 C14.1 C13.1 38.11,31.75 v33.27,31.75 | v12.1,27.94 10.41,27.94 9.46,28.89 9.46,33.34 10.1,33.97 20.89,33.97 | 20.89,33.97 22.16,33.97 22.48,34.29 v22.48,34.92 | v20.89,26.35 20.89,33.97 | 39.02,13.02 v41.53,13.02
  Bottom 0.152: v22.48,34.92 22.8,35.24 TP1.TP
  Bottom 0.305: v22.48,34.92 21.59,34.04 21.59,31.14 21.68,31.04 U2.12 26.53,31.04 27.17,31.68 | 27.17,31.68 27.82,32.33 U2.3 32.69,32.33 v33.27,31.75 33.21,31.68 U2.4 27.17,31.68
  Bottom 0.406: v45.34,27.3 45.26,27.23 R9.2 | D3.A v47.88,30.48 | R1.2 12.41,27.59 12.1,27.91 v12.1,27.94 | R2.2 18.24,27.1 18.99,26.35 v20.89,26.35
  Bottom 0.813: 42.99,19.05 L1.1 41.53,15.36 v41.53,13.02 | 42.99,19.05 42.99,23.29 R9.2 | C17.1 43.1,18.95 42.99,19.05
+24V0  (via drill 0.35)
  Top 0.305: U6.1 30.55,17.02 v31.37,16.19
  Bottom 0.152: TP4.TP 31.37,14.29 v31.37,16.19
  Bottom 0.305: v31.37,16.19 31.37,16.88 D1.C
  Bottom 0.813: D1.C 30.55,17.46 C19.1 C18.1 29.91,15.47 R17.2
A  (via drill 0.35)
  Top 0.406: SJ3.1 56.52,33.27 54.23,35.56 v52.7,35.56
  Bottom 0.305: R30.2 39.24,33.1 39.24,32.65 38.1,31.51 38.1,29.06 37.17,28.13 U8.6
  Bottom 0.406: R30.2 R28.1 44.24,40.01 51.44,40.01 52.7,38.73 v52.7,35.56
A-GND
  Top 0.61: X1.1 41.27,6.13 R23.2
A-OUT-1  (via drill 0.35)
  Top 0.406: SJ1.2 34.1,28.13 33.33,27.36 32.22,27.36 29.94,25.08 28.71,25.08 v28.61,25.18
  Bottom 0.406: v28.61,25.18 28.61,24.23 24.7,20.32 24.7,9.53 26.61,7.62 33.65,7.62 X1.2
B  (via drill 0.35)  (1 unrouted)
  Top 0.406: v52.39,33.02 53.98,33.02 v54.61,33.66
  Bottom 0.305: U8.7 37.65,26.86 38.31,27.51 38.31,28.22 38.73,28.65 38.73,31.5 39.7,32.47 39.7,32.92 42.17,35.39 43.01,35.39 43.81,36.19 R30.1 44.03,35.35 R29.1
  Bottom 0.406: 44.03,35.35 47.85,31.53 51.71,31.53 52.39,32.2 v52.39,33.02 | v54.61,33.66 55.88,32.38 55.88,23.06
B0  (via drill 0.35)  (1 unrouted)
  Top 0.406: SJ12.1 15.57,22.75 v15.57,23.5
  Bottom 0.406: 10.62,19.68 11.57,20.64 U1.5 14.21,20.64 14.76,21.19 14.76,22.68 v15.57,23.5
B1  (via drill 0.35)  (2 unrouted)
  Top 0.305: v6.99,22.23 6.99,25.41 9.23,27.66 9.23,28.22 8.26,29.2 8.26,32.06 8.41,32.22 8.41,32.38
  Bottom 0.305: SJ6.1 10.6,21.08 10.16,20.64 8.97,20.64 8.79,20.81 8.4,20.81 v6.99,22.23
  Bottom 0.406: U1.6 10.94,21.91 10.62,21.59
B2  (1 unrouted)
  Bottom 0.406: U1.7 10.94,23.18 10.62,23.49 | SJ4.1 SJ7.1
B3  (1 unrouted)
  Bottom 0.406: U1.2 21.94,23.18
B4  (1 unrouted)
  Bottom 0.406: U1.3 21.32,21.91 21.94,21.28
BASE  (via drill 0.35)
  Top 0.406: v33.27,22.23 32.59,21.54 Q5.1 | R10.2 33.91,19.37 33.27,20 v33.27,19.95
  Bottom 0.406: Q5.1 33.01,22.23 v33.27,22.23 v33.27,19.95
BOOT1
  Top 0.406: IC2.1 49.78,24.66 C12.2
C1+
  Top 0.305: U4.2 31.16,29.84 C1.1
C1-
  Top 0.305: U4.4 31.56,31.14 C1.2
C2+
  Top 0.305: U4.5 31.29,31.77 C2.1
C2-
  Top 0.305: U4.6 30.01,32.57 30.93,32.57 31.69,33.33 31.69,34.29 32.54,35.14 C2.2
COMP
  Top 0.152: TP13.TP 36.45,15.53 35.88,14.96
  Top 0.305: R16.2 30.63,15.24 35.5,15.24 35.88,14.86 U3.7 35.88,14.96 C16.1
D-OUT-1  (via drill 0.35)  (2 unrouted)
  Top 0.406: D5.1 28.32,7.25 v29.21,6.35 29.21,5.06 X1.4
  Bottom 0.406: SJ9.1 27.42,4.56 v29.21,6.35 33.97,6.35 35.88,4.45 35.88,2.86 37.15,1.59 51.75,1.59 57.78,7.62 57.78,19.48 55.88,21.39
D-OUT-2  (via drill 0.35)
  Top 0.406: SJ3.2 56.57,29.9 57.15,29.9 58.42,28.62 58.42,6.83 52.86,1.27 29.21,1.27 v28.57,1.91
  Top 0.61: D4.1 33.01,4.75 X1.3
  Bottom 0.406: X1.3 32.67,1.91 v28.57,1.91
DIN  (via drill 0.35)  (1 unrouted)
  Top 0.305: v26.92,28.26 25.97,28.26 25.02,29.21 25.02,29.84 25.34,30.16 25.34,32.07 24.99,32.42 U4.11 25.11,32.42 v25.52,32.82
  Top 0.406: v46.99,35.56 36.2,35.56 v35.56,36.2
  Bottom 0.305: v26.92,28.26 26.92,24.45 23.75,21.27 22.94,21.27 22.93,21.28
  Bottom 0.406: U8.4 33.84,29.4 36.2,31.75 36.83,31.75 38.1,33.02 38.1,33.66 36.83,34.92 35.56,34.92 34.29,36.2 | v25.52,32.82 26.99,34.29 28.57,34.29 29.21,34.92 29.21,37.47 29.84,38.1 32.38,38.1 34.29,36.2 | R27.1 48.26,34.29 v46.99,35.56 | v35.56,36.2 34.29,36.2
DOUT  (via drill 0.35)
  Top 0.305: U4.13 22.39,31.14 22.05,30.8 22.05,26.47 22.16,26.35 v22.48,26.35
  Top 0.406: SJ3.3 57.78,27.05 57.78,6.99 52.7,1.91 30.48,1.91 29.21,3.17 29.21,3.81 27.94,5.08 24.77,5.08 24.02,5.82 v24.02,24.09
  Bottom 0.305: 24.07,24.13 v24.02,24.09
  Bottom 0.406: v22.48,26.35 24.07,24.77 24.07,24.13
DRAIN  (via drill 0.35)
  Top 0.406: C10.2 R13.2 35.18,23.18 v34.54,23.81
  Bottom 0.406: v34.54,23.81 33.54,23.81 Q6.3
FB
  Top 0.152: R19.2 27.66,11.33 TP8.TP
  Top 0.305: R18.1 29.39,14.63 34.57,14.63 U3.8
  Top 0.406: R18.1 28.09,12.18 R19.2
FREQ
  Top 0.152: TP12.TP 30.95,10.2 R15.2
  Top 0.305: R15.2 30.95,13.23 31.69,13.97 33.85,13.97 U3.9
GATE  (via drill 0.35)
  Top 0.406: U7.8 47.85,13.05 47.56,13.34 v47.24,13.34 46.29,14.29 Q3.1
  Bottom 0.406: v47.24,13.34 47.1,13.34 Q2.1
GND  (via drill 0.35)
  Top 0.152: U6.10 28.15,20.59 28.54,20.99 | U6.11 28.54,20.99 | U6.9 27.85,20.99 28.54,20.99
  Top 0.305: U3.14 35.88,12.13 U3.17
  other vias: 50.1,8.57 52.01,8.26 54.86,6.99 50.74,5.71 55.82,1.91 46.93,8.26 46.93,7.3 50.42,15.56 49.47,16.51 47.88,21.59 47.88,20.32 52.64,19.05 52.64,22.86 54.55,24.77 52.01,28.26 46.61,30.8 14.54,8.45 11.68,19.37 9.14,25.08 12.64,12.38 9.78,11.75 11.37,17.46 15.49,20.95 17.4,20.95 27.24,30.48 22.8,27.94 25.08,25.27 27.05,32.64 29.78,28.19 25.21,27.94 35.05,32.7 26.8,20 25.53,14.92 32.51,12.7 30.04,13.91 42.04,11.43 44.51,22.42 40.39,24.7 10.48,33.02
  pour Top: 0,41.91 0,0 62.54,0 62.54,41.91
  pour Bottom: 0,41.91 0,0 62.54,0 62.54,41.91
IS
  Top 0.305: Q5.2 33.32,20.64 31.69,20.64 31.23,21.09 U6.2
  Top 0.406: R10.1 34.22,21.49 Q5.2
LOAD
  Top 0.406: SJ1.3 37.93,23.22 R13.1 39.84,23.18 R14.1
  Top 0.61: R14.1 40.42,23.07 43.44,20.06 D6.2
MISO  (via drill 0.35)  (1 unrouted)
  Top 0.406: PAD2.1 10.47,23.05 v8.51,23.05
  Bottom 0.406: v8.51,23.05 8.51,21.91 8.83,21.59 9.58,21.59
MOSI  (via drill 0.35)  (1 unrouted)
  Top 0.406: PAD3.1 16.13,26.47 16.13,25.72 11.37,20.95 9.14,20.95 8.51,20.32 v8.51,20.13
  Bottom 0.406: v8.51,20.13 8.96,19.68 9.58,19.68
N$1
  Top 0.305: R16.1 C15.1
N$2
  Bottom 0.406: R5.2 R4.1
N$3  (via drill 0.35)
  Top 0.406: v47.33,14.61 48.05,14.61 Q3.2
  Bottom 0.406: Q2.2 46.46,10.79 45.02,10.79 44.7,11.11 44.7,13.02 46.29,14.61 v47.33,14.61
N$4
  Bottom 0.406: R6.2 51.35,11.68 R5.1
N$5
  Top 0.406: R11.2 44.08,24.34 R12.1
N$6  (via drill 0.35)
  Top 0.305: R18.2 25.65,12.6 v25.65,12.06
  Bottom 0.305: v25.65,12.06 25.65,12.91 R17.1
OV  (via drill 0.35)
  Top 0.406: U7.3 49.15,9.21 49.15,8.34 49.56,7.92 49.56,6.76 49.76,6.57 v49.78,6.57
  Bottom 0.152: TP9.TP 55.04,9.98 R7.2
  Bottom 0.406: v49.78,6.57 52.9,6.57 54.62,8.29 R7.2 R6.1
PH
  Top 0.406: D2.C 51.19,16.9 IC2.8 49.78,21.27 52.22,23.71 C12.1 53.72,26.9 L2.1
RESET  (via drill 0.35)
  Top 0.406: v16.76,31.43 16.54,31.66 PAD6.1
  Bottom 0.406: U1.1 18.67,24.45 17,26.11 17,28.89 17.54,29.43 18.87,29.43 19.08,29.64 19.08,30.93 18.87,31.14 17.06,31.14 v16.76,31.43
RIN  (via drill 0.35)  (1 unrouted)
  Top 0.305: U4.8 29.82,33.66 29.15,33.66 26.56,31.07 26.56,29.91 26.92,29.54 v26.92,29.53
  Bottom 0.406: v26.92,29.53 27.88,28.57 27.88,24.45 24.07,20.64 24.07,9.21 26.04,7.24 26.04,5.92
ROUT  (via drill 0.35)  (1 unrouted)
  Top 0.305: v25.97,29.53 25.97,32 26.35,32.38 26.35,33.34 25.99,33.7 25.4,33.7 | 25.4,33.7 U4.9 | v25.72,34.29 25.4,33.97 25.4,33.7
  Top 0.406: v46.99,37.47 v22.23,37.47
  Bottom 0.305: v25.97,29.53 25.97,24.45 24.7,23.18 22.94,23.18 22.93,23.18
  Bottom 0.406: U8.1 33.21,25.59 34.29,26.67 34.29,29.05 36.43,31.19 37.06,31.19 38.73,32.87 38.73,34.45 34.52,38.66 29.61,38.66 | v25.72,34.29 26.04,34.29 26.67,34.92 27.94,34.92 28.57,35.56 28.57,37.62 29.61,38.66 | R24.1 48.26,32.38 45.72,34.92 45.72,36.2 v46.99,37.47 | v22.23,37.47 23.42,38.66 29.61,38.66
SCK  (via drill 0.35)
  Top 0.406: v10.41,29.21 13.9,29.21 PAD4.1
  Bottom 0.406: SJ7.2 9.59,28.38 v10.41,29.21
SCL_3V3  (via drill 0.35)
  Top 0.305: v15.52,8.33 14.81,7.62 11.67,7.62 10.91,8.38 10.91,12.52 v10.73,12.7
  Top 0.61: R22.1 20.47,19.05 18.9,19.05 18.38,18.53 15.93,18.53 10.73,13.34 v10.73,12.7
  Bottom 0.305: U5.2 14.7,10 15.52,9.18 v15.52,8.33
  Bottom 0.406: SJ4.2 9.27,23.81 8.19,23.81 7.81,24.19 | Q4.2 16.94,33.34 12,33.34 7.81,29.15 7.81,24.19 | 7.81,24.19 7.56,24.45 5.87,22.76 5.87,21.69 10.73,16.83 v10.73,12.7
SCL_5V0
  Bottom 0.406: Q4.3 20.09,29.84 | 20.09,29.84 20.09,27.74 R2.1 | U2.10 20.17,29.76 20.09,29.84
SDA_3V3  (via drill 0.35)
  Top 0.305: v13.59,8.3 11.64,8.3 11.37,8.57 11.37,12.16 v11.59,12.38
  Top 0.406: v8.54,27.94 5.87,25.27 5.87,21.73 7.87,19.73 7.87,19.68 9.14,18.41 13.91,18.41 14.73,19.23 | 14.73,19.23 SJ12.2 | R20.1 17.8,19.23 v15.24,19.23 14.73,19.23
  Bottom 0.305: U5.4 13.2,8.51 13.4,8.3 v13.59,8.3
  Bottom 0.406: Q1.2 11.44,30.16 9.78,30.16 8.51,28.89 8.51,27.94 v8.54,27.94 | v15.24,19.23 15.17,19.3 11.59,15.72 v11.59,12.38
SDA_5V0  (via drill 0.35)
  Top 0.406: v18.1,33.24 17.56,32.7 15.91,32.7 v15.81,32.6
  Bottom 0.406: R1.1 15.46,27.74 Q1.3 15.46,32.25 v15.81,32.6 | U2.11 21.6,30.4 21.08,30.92 21.08,31.88 19.62,33.34 18.2,33.34 v18.1,33.24
SET
  Top 0.152: U6.7 26.32,22.09 R21.1
SHDN
  Top 0.406: U7.5 50.57,13.02 53.88,13.02 54.53,12.37 R8.1
SS
  Top 0.152: TP11.TP 38.42,14.85 38.42,13.98
  Top 0.305: C6.1 42.28,13.98 38.42,13.98 U3.4
SW  (via drill 0.35)
  Top 0.305: 40.46,11.63 U3.1 U3.16 U3.15
  Top 0.406: 40.46,11.63 v40.58,11.75
  Bottom 0.813: D1.A 38.16,17.46 L1.2 40.56,15.06 40.56,12.62 40.58,12.61 v40.58,11.75
UV  (via drill 0.35)
  Top 0.152: TP10.TP 55.6,11.43 55.13,10.96 53.65,10.96 R3.1
  Top 0.406: U7.2 48.51,9.94 48.51,7.94 v48.83,7.62 | R3.1 52.25,11.11 52.01,11.11 51.69,10.79 v51.69,9.21
  Bottom 0.406: v48.83,7.62 49.15,7.3 50.42,7.3 50.94,7.82 R4.2 50.94,9.96 v51.69,9.21
V+
  Top 0.305: U4.3 29.68,30.32 29.12,30.32 27.66,28.86 C3.1
V-
  Top 0.305: U4.7 30.76,33.05 31.05,33.34 31.05,34.51 30.32,35.24 C4.1
V-OUT-1  (via drill 0.35)
  Top 0.305: U6.6 27.75,23.05 28.41,23.71 v29.86,23.71
  Bottom 0.152: v29.86,23.71 30.73,22.84 TP5.TP
  Bottom 0.305: U2.8 28.65,26.53 29.46,25.72 29.46,24.11 v29.86,23.71
V-OUT-2  (via drill 0.35)
  Top 0.305: v33.59,30.48 33.78,30.67 SJ1.1
  Bottom 0.152: TP6.TP 33.91,30.48 v33.59,30.48
  Bottom 0.305: U2.2 33.63,32.98 34.23,32.38 34.23,31.43 33.59,30.8 v33.59,30.48
  Bottom 0.406: D7.1 31.38,36.83 32.38,36.83 35.88,33.34 TP6.TP
VG  (via drill 0.35)
  Top 0.305: U6.3 31.05,21.59 31.37,21.91 31.37,22.54 32.37,23.54 Q5.3
  Top 0.406: Q5.3 33.96,22.86 v34.23,22.86
  Bottom 0.406: v34.23,22.86 Q6.1
VIN
  Top 0.406: R8.2 R3.2 52.87,5.86 50.51,3.5 X2.1 47.85,4.9 U7.1
  Bottom 0.406: X2.1 49.24,6.07 48.1,7.22 48.1,8.21 Q2.3
VIN_5V0
  Bottom 0.152: C9.1 45.02,30.06 TP2.TP
  Bottom 0.406: IC1.3 50.74,27.3 51.05,26.99 51.05,25.72 50.74,25.4 IC1.1 | IC1.3 47.21,29.84 C9.1 | IC1.3 52.22,29.77 D3.C
VIN_30
  Top 0.406: C11.1 50.1,14.29 | 50.1,14.29 49.78,14.29 48.5,13 U7.7 | 50.1,14.29 47.73,16.66 Q3.3 48.51,17.93 IC2.7
VSENSE  (via drill 0.35)
  Top 0.406: R12.2 45.97,24.54 IC2.4 45.23,23.61 v45.02,23.81
  Bottom 0.152: TP7.TP 45.34,23.5 v45.02,23.81
  Bottom 0.406: v45.02,23.81 45.66,24.45 45.97,24.45 46.96,25.44 R9.1

### Text on the board
tPlace: SGS Weather & Environmental Systems / SGB022 v2.0 rev. D | V | I | RST | GND | MOSI | SCK | MISO | +3V3 | RX/B | TX/A | A-OUT | GND | GND | VIN
tNames: 0-5 V | RS485 | 4-20 mA | * | RS232 | U7
bNames: * | Hole | #
_tNames: C4 | C2 | SJ1 | SJ2 | C1 | C13 | C14 | U4 | C5 | R12 | SJ3 | C3 | R13 | L2 | Q5 | R11 | C12 | C10 | IC2 | SJ12 | R14 | R20 | R21 | R22 | U6 | D6 | R10 | R16 | D2 | C16 | Q3 | C15 | TP13 | TP11 | C11 | R18 | R15 | C6 | TP10 | U3 | TP12 | R19 | R3 | R8 | D5 | TP8 | D4 | R23
_bNames: R28 | R25 | D7 | R26 | TP1 | R30 | U2 | TP6 | R29 | R27 | Q4 | TP2 | R24 | Q1 | D3 | C8 | C9 | SJ7 | R1 | R2 | SJ10 | IC1 | U8 | SJ4 | R9 | TP7 | SJ6 | TP5 | SJ8 | SJ5 | SJ11 | Q6 | L1 | U1 | C19 | D1 | C17 | C18 | TP4 | R17 | U5 | TP3 | Q2 | R4 | R5 | C7 | R6 | R7 | TP9 | SJ9 | X2 | X1